# EasyEDA Pro project ProPrj_Proj_mamba_2026-04-01.epro, board PCB2
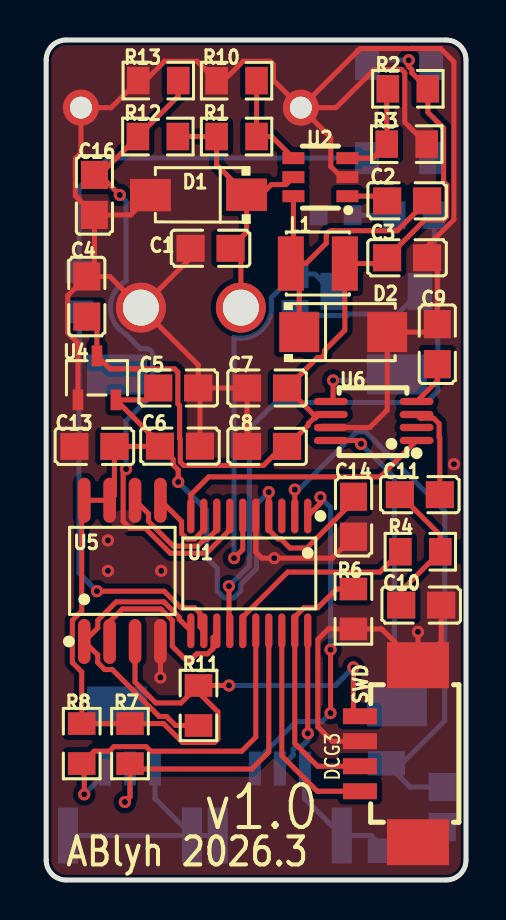
[diagram p2: board, top side]
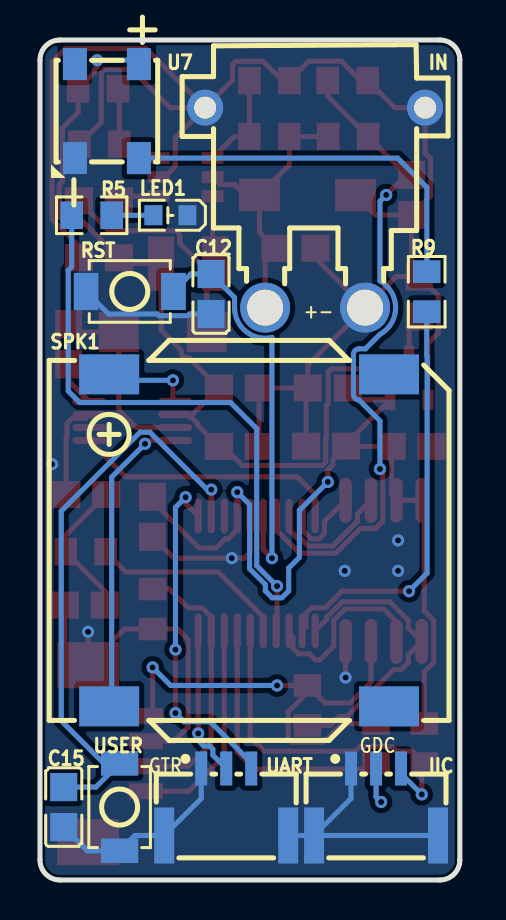
[diagram p3: board, bottom side, seen from below]

Outline 21 x 42 mm; copper layers: Top Layer, Bottom Layer. Coordinates in mm from the lower left corner of the outline.
Outline path: 0,41 0,1 arc(0.29,0.29) 1,0 20,0 arc(20.71,0.29) 21,1 21,41 arc(20.71,41.71) 20,42 1,42 arc(0.29,41.71) 0,41
Stack: Top Layer 0.035mm / Dielectric1 1.51mm FR4 er 4.5 / Bottom Layer 0.035mm

## Design rules (mm)
spacing copperThickness1oz (default): track to track 0.102, other pairs 0.152 to 0.3
spacing copperThickness2oz: track to track 0.203, other pairs 0.152 to 0.3
track width copperThickness1oz (default): min 0.127, default 0.254, max 2.54
track width copperThickness2oz: min 0.203, default 0.254, max 2.54
differential pair differentialPair (default): width min 0.127, default 0.254, max 2.54; gap min 0.152, default 0.152
pour e605 uses copperRegion1, copperThickness1oz
pour e611 uses copperRegion1, copperThickness1oz

## Placement (name value [footprint] x y rotation side)
C1  4.7uF  [C0805]  8.22 31.59 180 top
C2  100nF  [C0805]  18.06 33.96 0 top
C3  10uF  [C0805]  18.05 31.11 180 top
C4  1uF  [C0805]  2.03 29.17 270 top
C5  1uF  [C0805]  6.6 24.6 180 top
C6  100nF  [C0805]  6.69 21.69 180 top
C7  10uF  [C0805]  11.05 24.6 0 top
C8  1uF  [C0805]  11.05 21.68 0 top
C9  100nF  [C0805]  19.56 26.79 270 top
C10  10nF  [C0805]  18.76 13.75 0 top
C11  100nF  [C0805]  18.69 19.27 0 top
C12  100nF  [C0805]  12.45 29.3 90 bottom
C13  100nF  [C0805]  2.41 21.68 0 top
C14  4.7uF  [C0805]  15.38 18.16 90 top
C15  100nF  [C0805]  19.81 3.65 90 bottom
C16  10nF  [C0805]  2.41 34.25 90 top
D1  SMAJ33A  [SMA_L4.3-W2.6-LS5.0-RD]  7.62 34.25 180 top
D2  SS14  [SMA_L4.3-W2.6-LS5.2-RD]  14.86 27.39 0 top
IIC  WAFER-GH1.25-3PLB  [CONN-SMD_3P-P1.25_XUNPU_WAFER-GH1.25-3PLB]  4.19 3.9 180 bottom
IN  XT30PW-M30.G.Y  [CONN-TH_XT30PW-M]  7.24 33.62 0 bottom
L1  22uH  [IND-SMD_L3.0-W3.0_FNR30XXS]  13.59 30.82 180 top
LED1  GL0603UR01  [LED0603-FD]  14.48 33.24 180 bottom
R1  100kΩ  [R0805]  9.53 37.17 180 top
R2  124kΩ  [R0805]  18.09 39.56 180 top
R3  23.7kΩ  [R0805]  18.03 36.79 180 top
R4  1kΩ  [R0805]  18.72 16.41 0 top
R5  1kΩ  [R0805]  18.41 33.24 180 bottom
R6  10kΩ  [R0805]  15.37 13.55 270 top
R7  4.7kΩ  [R0805]  4.19 6.82 90 top
R8  4.7kΩ  [R0805]  1.78 6.82 90 top
R9  100Ω  [R0805]  1.66 29.42 270 bottom
R10  10kΩ  [R0805]  9.53 39.97 0 top
R11  10kΩ  [R0805]  7.62 8.73 270 top
R12  100kΩ  [R0805]  5.59 37.17 0 top
R13  10kΩ  [R0805]  5.61 39.97 180 top
RST  TS-1088-AR02016  [SW-SMD_L3.9-W3.0-P4.45]  16.51 29.43 180 bottom
SPK1  FS2045  [BUZ-SMD_4P-L20.0-W20.0_FS2045]  10.54 16.98 270 bottom
SWD  HX12501-4AWB  [CONN-SMD_4P-P1.25_HX12501-4AWB]  17.15 6.31 90 top
U1  STM32G030F6P6  [TSSOP-20_L6.5-W4.4-P0.65-LS6.4-BL]  10.16 15.33 180 top
U2  MP2459GJ-Z  [SOT-23-6_L2.9-W1.6-P0.95-LS2.8-BR]  13.72 35.14 0 top
U4  XC6206P332MR  [SOT-23-3_L3.0-W1.7-P0.95-LS2.9-BR]  2.54 25.11 270 top
U5  W25Q32JVSSIQ  [SOIC-8_L5.3-W5.3-P1.27-LS8.0-BL]  3.81 15.46 0 top
U6  PAM8302AASCR  [MSOP-8_L3.0-W3.0-P0.65-LS5.0-BL]  16.38 22.95 90 top
U7  WS2812  [LED-SMD_4P-L5.0-W5.0-TL-A]  17.65 38.44 270 bottom
UART  WAFER-GH1.25-3PLB  [CONN-SMD_3P-P1.25_XUNPU_WAFER-GH1.25-3PLB]  11.68 3.9 180 bottom
USER  TS-1088-AR02016  [SW-SMD_L3.9-W3.0-P4.45]  17.02 3.65 90 bottom

## Footprints (pads in the part's own frame, mm; a bottom-side part is the same pattern mirrored in y, then rotated)
BUZ-SMD_4P-L20.0-W20.0_FS2045
  rect 2x3 smd: 1(-8.3,-7) 2(8.3,-7) 3(8.3,7) 4(-8.3,7)
C0805
  rect 1.41x1.35 smd: 1(-1,0) 2(1,0)
CONN-SMD_3P-P1.25_XUNPU_WAFER-GH1.25-3PLB
  rect 0.6x1.7 smd: 1(-1.25,1.675) 2(0.001,1.675) 3(1.25,1.675)
  rect 1x2.8 smd: 4(3.1,-1.675) 5(-3.1,-1.675)
CONN-SMD_4P-P1.25_HX12501-4AWB
  rect 0.8x1.7 smd: 1(-1.875,1.45) 2(-0.625,1.45) 3(0.625,1.45) 4(1.875,1.45)
  rect 2.3x3.1 smd: 5(4.425,-1.45) 6(-4.425,-1.45)
CONN-TH_XT30PW-M
  round 2.5 hole 1.8: 1(-2.5,5) 2(2.5,5)
  round 1.8 hole 1.1: 3(5.5,-5) 4(-5.5,-5)
IND-SMD_L3.0-W3.0_FNR30XXS
  rect 1.3x2.72 smd: 1(1.35,0) 2(-1.35,0)
LED0603-FD
  rect 0.9x1 smd: 1(-0.85,0) 2(0.85,0)
LED-SMD_4P-L5.0-W5.0-TL-A
  rect 1.6x1.2 smd: 1(-2.35,1.6) 2(-2.35,-1.6) 3(2.35,-1.6) 4(2.35,1.6)
MSOP-8_L3.0-W3.0-P0.65-LS5.0-BL
  oval 0.364x1.692 smd: 1(-0.975,-2.146) 2(-0.325,-2.146) 3(0.325,-2.146) 4(0.975,-2.146) 5(0.975,2.146) 6(0.325,2.146) 7(-0.325,2.146) 8(-0.975,2.146)
R0805
  rect 1.133x1.377 smd: 1(-1,0) 2(1,0)
SMA_L4.3-W2.6-LS5.0-RD
  rect 2.046x1.62 smd: 1(-2.404,-0.009) 2(2.404,0.009)
SMA_L4.3-W2.6-LS5.2-RD
  rect 2x2 smd: 1(-2.2,0) 2(2.2,0)
SOIC-8_L5.3-W5.3-P1.27-LS8.0-BL
  oval 0.63x2.25 smd: 1(-1.905,-3.53) 2(-0.635,-3.53) 3(0.635,-3.53) 4(1.905,-3.53) 5(1.905,3.53) 6(0.635,3.53) 7(-0.635,3.53) 8(-1.905,3.53)
SOT-23-3_L3.0-W1.7-P0.95-LS2.9-BR
  rect 1.038x0.532 smd: 1(1.101,-0.95) 2(1.101,0.95) 3(-1.101,0)
SOT-23-6_L2.9-W1.6-P0.95-LS2.8-BR
  rect 1.1x0.6 smd: 1(1.35,-0.95) 2(1.35,0) 3(1.35,0.95) 4(-1.35,0.95) 5(-1.35,0) 6(-1.35,-0.95)
SW-SMD_L3.9-W3.0-P4.45
  rect 1.23x1.86 smd: 1(-2.185,0) 2(2.185,0)
TSSOP-20_L6.5-W4.4-P0.65-LS6.4-BL
  oval 0.364x1.742 smd: 1(-2.925,-2.871) 2(-2.275,-2.871) 3(-1.625,-2.871) 4(-0.975,-2.871) 5(-0.325,-2.871) 6(0.325,-2.871) 7(0.975,-2.871) 8(1.625,-2.871) 9(2.275,-2.871) 10(2.925,-2.871) 11(2.925,2.871) 12(2.275,2.871) 13(1.625,2.871) 14(0.975,2.871) 15(0.325,2.871) 16(-0.325,2.871) 17(-0.975,2.871) 18(-1.625,2.871) 19(-2.275,2.871) 20(-2.925,2.871)

## Nets
As in the schematic.

Pads without a net: SPK1 3 4; U1 3; U6 2; U7 2

## Via types
v1: diameter 0.61, hole 0.305, Top Layer to Bottom Layer, 26 vias

## Routing (per net, layer and track width the routed paths; a pad name or vN(x,y) marks a point on that pad's centre or on a via; arc(x,y) is an arc through that point)
3V3: length 73.7
  Top Layer w0.254: C6.2 5.69,21.81 U4.2 5.01,24.01 C5.2 ; C6.2 5.68,21.68 C13.2 3.41,19.22 U5.7 U5.8 1.78,18.86 1.78,13.45 1.31,12.98 1.31,10.87 1.78,10.4 R8.2 R7.2 5.88,7.82 6.82,6.88 8.42,6.88 8.59,7.04 8.59,8.41 7.62,9.38 R11.1 ; C6.2 6.35,21.03 6.35,20.75 6.6,20.5 v1(6.6,19.9) ; v1(11.13,19.39) U1.4 11.13,17.51 11.59,17.05 11.74,17.05 12.19,16.6 13.04,16.6 15.38,18.94 C14.2 ; R11.1 6.75,8.85 5.48,8.85 4.44,9.89 4.44,11.93 ; R11.1 v1(9.14,9.73) ; SWD.4 15.37,8.52 v1(15.37,10.63)
  Bottom Layer w0.254: v1(6.6,19.9) 8.03,18.48 8.03,16.13 8.56,15.6 8.56,14.45 8.9,14.11 9.39,14.11 9.73,14.45 9.73,14.78 10.52,15.56 10.52,18.78 v1(11.13,19.39) ; v1(9.14,9.73) 14.46,9.73 v1(15.37,10.63)
5V: length 46.3
  Top Layer w0.254: v1(18.14,40.99) 18.14,40.67 18.29,40.51 18.29,40.36 R2.1 19.09,38.39 19.88,37.6 19.88,34.92 20.04,34.76 20.04,33.17 19.88,33 18.94,33 C3.2 16.76,30.82 L1.2 14.94,27.49 13.94,26.49 13.94,26.39 arc(13.86,26.2) 13.66,26.12 13.56,26.12 C7.2 13.38,23.28 13.64,23.28 ; 13.64,23.28 13.46,23.09 13.38,23.09 13.11,22.82 13.11,22.74 C8.2 11.82,21.68 10.87,20.73 6.88,20.73 6.71,20.9 6.71,22.04 6.68,22.08 6.68,23.72 6.59,23.81 6.59,25.39 6.42,25.56 3.2,25.56 U4.3 2.54,27.67 C4.2 ; 13.64,23.28 U6.6
  Bottom Layer w0.254: 18.14,40.99 16.25,40.99 U7.1
24V: length 14.4
  Top Layer w0.254: U2.5 12,34.77 11.26,34.77 10.75,34.26 D1.1 ; D1.1 10.02,32.39 C1.1 9.74,31.07 IN.2 ; D1.1 8.53,35.76 R1.2 R12.2
GND: length 156.9
  Top Layer w0.254: C16.1 4.23,33.25 D1.2 ; C16.1 2.41,30.55 C4.1 ; C16.1 1.46,34.21 1.46,36.07 1.74,36.35 IN.4 3.25,38.62 R13.2 4.96,39.97 5.93,40.94 7.55,40.94 R10.1 8.88,39.97 9.84,40.94 11.21,40.94 11.37,40.77 11.37,39.99 IN.3 ; C1.2 7.22,31.1 IN.1 ; SWD.5 v1(18.59,12.41) ; SWD.5 19.76,11.9 C10.2 ; SWD.5 16.78,12.55 R6.2 14.11,12.55 13.59,12.03 13.59,7.65 14.3,6.94 SWD.3 ; U4.1 1.59,26.84 1.08,27.35 1.08,29.22 C4.1 ; IN.1 7.6,25.75 C5.1 ; IN.1 3.18,30.17 C4.1 ; 12.75,38.62 15.7,41.57 19.73,41.57 20.4,40.91 20.4,33.02 19.05,31.68 C3.1 19.56,30.6 C9.1 19.17,27.39 D2.2 17.06,23.5 16.19,22.62 U6.7 ; 12.75,38.62 IN.3 ; 12.75,38.62 14.5,38.62 16.41,40.53 17.77,40.53 17.94,40.36 17.94,37.89 R3.1 ; IN.3 14.24,37.12 14.24,35.68 14.77,35.14 U2.2 ; C5.1 C7.1 C8.1 ; C5.1 7.69,24.51 C6.1 ; 5.72,11.93 v1(5.72,10.12) ; C14.1 14.3,16.09 v1(11.41,16.09) 10.79,16.09 10.49,16.4 U1.5
  Bottom Layer w0.254: 8.58,2.22 7.29,2.22 ; 7.29,2.22 5.44,4.08 IIC.1 ; 7.29,2.22 1.09,2.22 ; C15.1 18.63,1.46 USER.1 16.25,2.22 14.78,2.22 12.93,4.08 UART.1 ; C12.1 13.51,28.3 13.59,28.22 15.06,28.22 15.14,28.3 17.57,28.3 RST.1
  vias: v1(3.09,16.98) v1(3.09,15.46) v1(5.76,15.46) v1(20.4,20.79)
ADC: length 33.7
  Top Layer w0.254: 2.67,35.25 2.68,35.25 v1(3.68,34.25) ; 2.67,35.25 C16.2 ; 2.67,35.25 R12.1 6.61,39.19 R13.1 ; 4,20.59 3.85,20.44 3.85,17.93 4.2,17.58 4.97,17.58 6.21,16.34 8.01,16.34 9.19,17.51 U1.7
  Bottom Layer w0.254: v1(3.68,34.25) 4,33.94 4,29.95 arc(3.42,29.39) 3.21,28.62 arc(3.42,27.84) 4,27.28 4.72,26.56 5.04,26.56 arc(5.24,26.48) 5.32,26.28 5.32,24.28 arc(5.24,24.08) 5.04,24 4,22.96 v1(4,20.55)
AMP_SHDN: length 13.5
  Top Layer w0.254: U1.10 7.24,19.26 8.13,20.16 16.71,20.16 U6.1
CLK: length 13.6
  Top Layer w0.254: SWD.2 13.58,5.69 12.44,6.83 U1.19 12.44,13.15 12.89,13.61 13.59,13.61 14.53,14.55 R6.1
DIO: length 10.9
  Top Layer w0.254: SWD.1 13.56,4.44 11.78,6.21 U1.18
FLASH_CS: length 14.7
  Top Layer w0.254: R11.2 6.47,7.73 6.02,8.18 5.66,8.18 3.31,10.52 2.93,10.52 2.58,10.87 2.58,11.25 1.91,11.93 2.58,12.6 2.58,12.98 3.51,13.91 5.89,13.91 6.66,13.13 6.66,13.03 U1.11
PWM: length 9.9
  Top Layer w0.254: U1.15 9.84,13.15 12.08,15.4 16.7,15.4 R4.1
RX: length 17.3
  Top Layer w0.254: v1(14.22,11.52) v1(14.22,8.34) ; U1.1 13.72,18.83 v1(13.72,19.14)
  Bottom Layer w0.254: v1(13.72,19.14) 14.22,18.63 v1(14.22,11.52) ; v1(14.22,8.34) 13.79,7.91 12.48,7.91 10.43,5.87 UART.3
SCL: length 18.1
  Top Layer w0.254: U1.16 10.49,7.15 9.78,6.44 5.22,6.44 5,6.67 3.39,6.67 3.16,6.44 2.4,6.44 R8.1 1.91,5.69 v1(1.91,4.28)
  Bottom Layer w0.254: v1(1.91,4.28) 2.94,5.32 IIC.3
SDA: length 17.3
  Top Layer w0.254: v1(3.94,3.9) 4.19,4.15 R7.1 4.46,5.55 10.29,5.55 11.13,6.4 U1.17
  Bottom Layer w0.254: v1(3.94,3.9) 4.19,4.15 IIC.2
SPI1_MISO: length 9.4
  Top Layer w0.254: 3.18,11.93 3.18,12.92 3.81,13.55 5.74,13.55 6.31,12.98 6.31,11.69 6.99,11.01 7.24,11.01 7.54,11.31 8.08,11.31 8.35,11.58 8.35,12.12 8.53,12.31 U1.13
SPI1_MOSI: length 4.2
  Top Layer w0.254: U1.9 7.92,18.17 7.92,17.54 7.43,17.05 7.04,17.05 6.77,17.32 6.77,17.93 U5.5
SPI1_SCK: length 6.3
  Top Layer w0.254: U1.8 8.51,18.17 8.51,17.48 8.08,17.05 7.93,17.05 7.57,16.69 6.36,16.69 5.12,17.93 5.12,18.31 U5.6
TX: length 7.6
  Top Layer w0.254: U1.20 v1(13.09,7.33)
  Bottom Layer w0.254: v1(13.09,7.33) 13.09,6.98 12.81,6.7 12.52,6.7 12.35,6.54 12.35,6.25 UART.2
WS2812: length 20.9
  Top Layer w0.254: v1(2.54,14.44) 5.9,14.44 6.74,13.61 7.43,13.61 7.7,13.34 7.7,12.65 U1.12
  Bottom Layer w0.254: v1(2.54,14.44) 1.63,15.35 1.63,26.15 arc(1.64,26.21) 1.66,26.27 R9.2
$1N24: length 19.2
  Bottom Layer w0.254: R9.1 1.65,30.42 1.65,34.63 3.11,36.09 U7.4
$1N33: length 2.1
  Bottom Layer w0.254: R5.2 LED1.1
$1N34: length 29.6
  Top Layer w0.254: v1(9.14,14.69) 9.14,12.5 U1.14
  Bottom Layer w0.254: R5.1 19.41,30.65 19.59,30.47 19.59,24.45 19.29,24.15 arc(19.25,24.09) 19.19,24.05 19.02,23.88 11.47,23.88 10.16,22.57 10.16,15.71 v1(9.14,14.69)
$1N47: length 29.2
  Top Layer w0.254: U1.2 v1(12.44,19.52)
  Bottom Layer w0.254: v1(12.44,19.52) 12.64,19.52 15.51,22.39 15.99,22.39 19.94,18.44 19.94,7.96 17.81,5.83 USER.2 18.2,4.65 C15.2
$1N49: length 20.5
  Top Layer w0.254: U1.6 9.84,16.53 v1(9.4,16.09)
  Bottom Layer w0.254: v1(9.4,16.09) 9.4,27.13 arc(10.69,27.42) 11.27,28.62 11.27,29.12 C12.2 13.45,30.3 RST.2
$1N53: length 4.9
  Top Layer w0.254: U6.3 18.72,23.09 19.38,23.09 19.65,22.82 19.65,22.15 19.69,22.11 C11.2
$1N54: length 7.2
  Top Layer w0.254: C11.1 19.72,17.24 R4.2 17.76,14.46 C10.1
$1N57: length 15.5
  Top Layer w0.254: U6.8 15.58,21.97 v1(15.75,21.81)
  Bottom Layer w0.254: 17.41,8.55 17.41,20.14 v1(15.75,21.81)
$1N58: length 4.2
  Top Layer w0.254: U6.5 14.35,24.04 v1(14.35,24.98)
  Bottom Layer w0.254: v1(14.35,24.98) 17.24,24.98 17.41,25.15
$1N59: length 2.3
  Top Layer w0.254: U6.4 19.56,24.96 C9.2
$1N83: length 5
  Top Layer w0.254: U2.3 16.33,36.09 R3.2 17.03,39.5 R2.2
$1N86: length 2.1
  Top Layer w0.254: C2.1 16.82,34.19 U2.1
$1N88: length 15.4
  Top Layer w0.254: C2.2 17.56,32.46 14.29,32.46 arc(14.09,32.38) 14.01,32.18 14.01,31.84 12.99,30.82 L1.1 ; L1.1 12.66,30.4 D2.1 ; L1.1 12.37,30.95 U2.6
$1N91: length 5.1
  Top Layer w0.254: U2.4 11.28,37.17 R1.1 R10.2

## Copper pours and planes (outline as drawn; the poured copper is in the pictures)
GND on Top Layer: -3.94,44.16 26.03,44.16 26.03,-2.7 -3.94,-2.7
GND on Bottom Layer: -3.94,45.05 25.15,45.05 25.15,-1.56 -3.94,-1.56

## Text on the board
Bottom Silkscreen Layer: GDC | +- | GTR
Top Silkscreen Layer: DCG3 | ABlyh 2026.3 | v1.0
